# Altium schematic sheet 59. CURRENT MONITORS -INA231.SchDoc: CURRENT MONITORS - INA231
size 513 x 386 mm; Project: PROC154E2(001)_SK_AM69; Issue: 1.0; RevCode: E3; Page Create Date: March  8, 1995; Variant Name: Core Design; Schematic Page Number: 59; Page Number: 59; Page Size: C; Comment: MISTRAL_TITLEBLK_CSIZE_1; Page Count: 62; Schematic Page Count: 62; Name: PROC154E2 001 SK AM69; DsnPath: C:\Users\danie\Downloads\sprr466c\PROC154E3_RP\PROC154E3_SCH.DSN; SchematicName: SCHEMATIC1; PageName: 59. CURRENT MONITORS -INA231; PageSize: C; TopSchematic: True
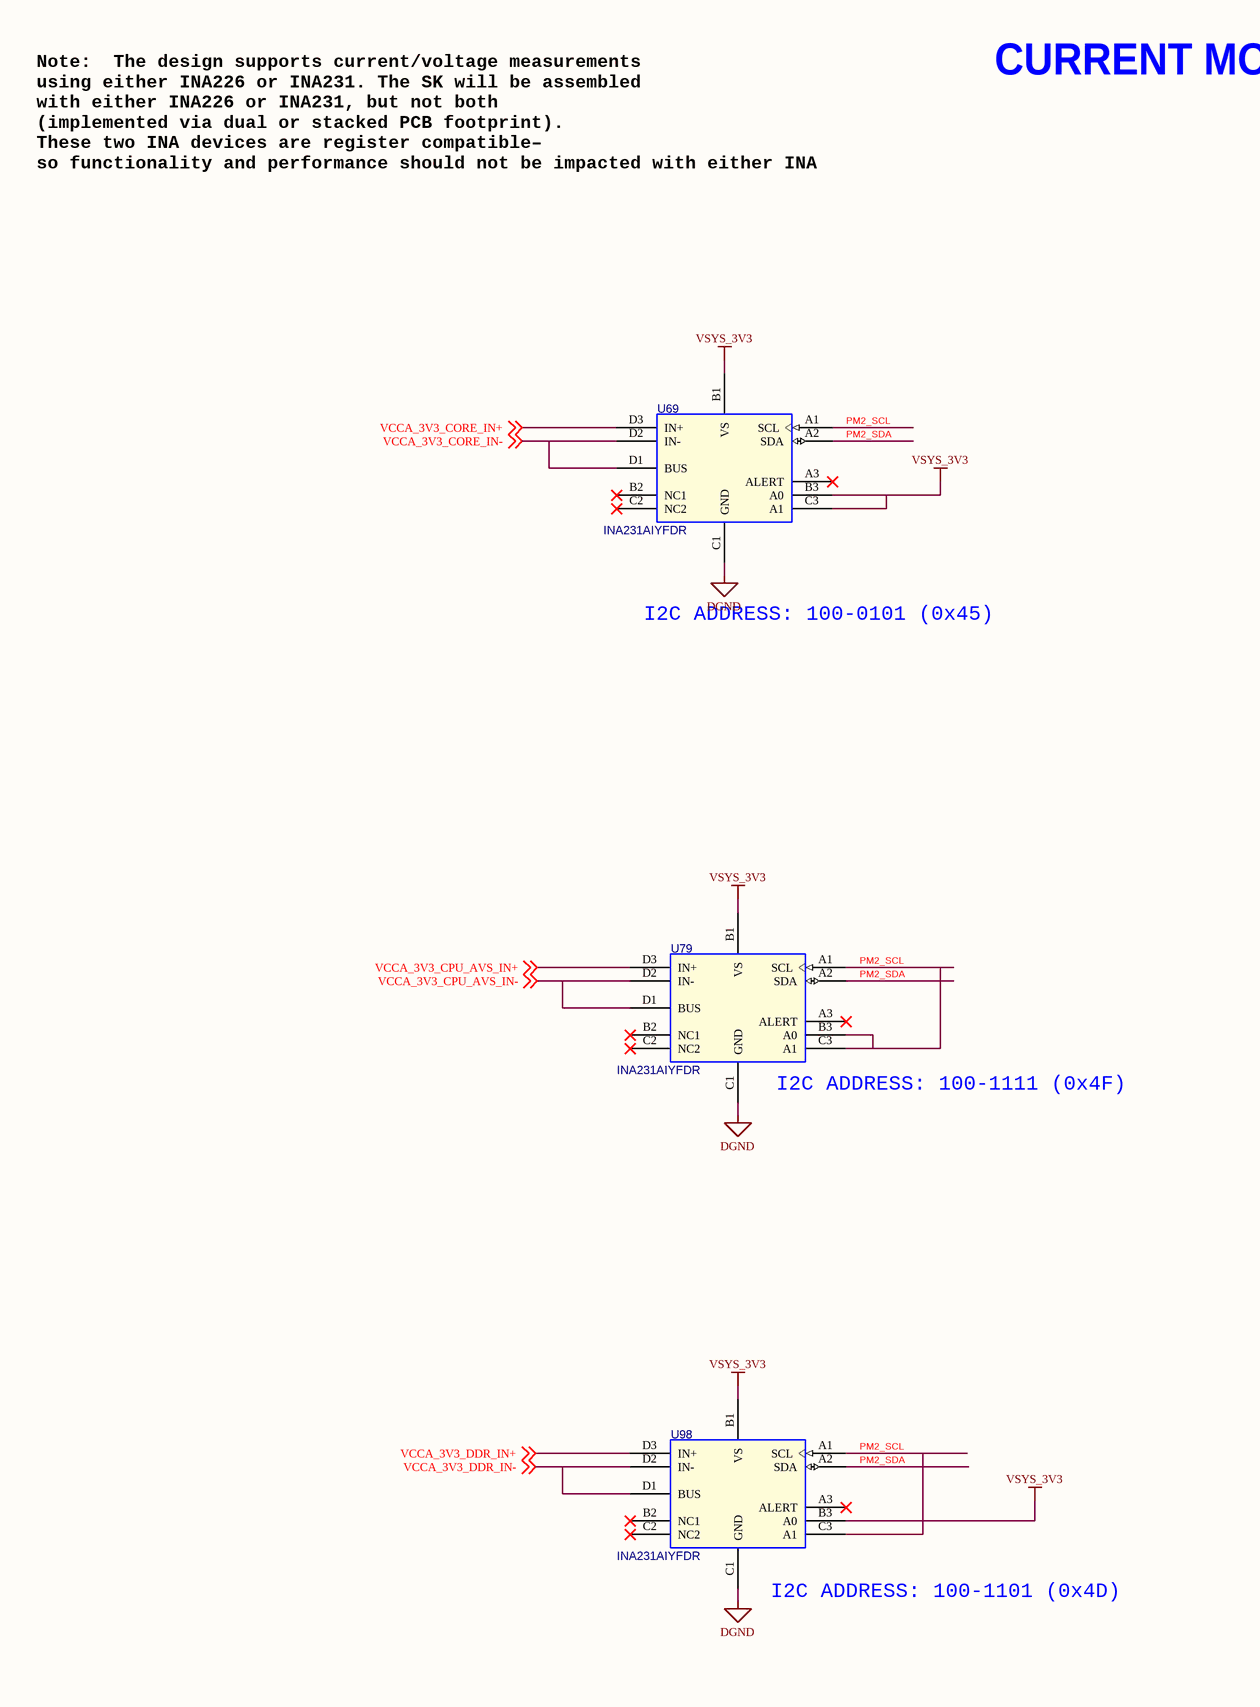
[diagram p0: 59. CURRENT MONITORS -INA231.SchDoc, left]
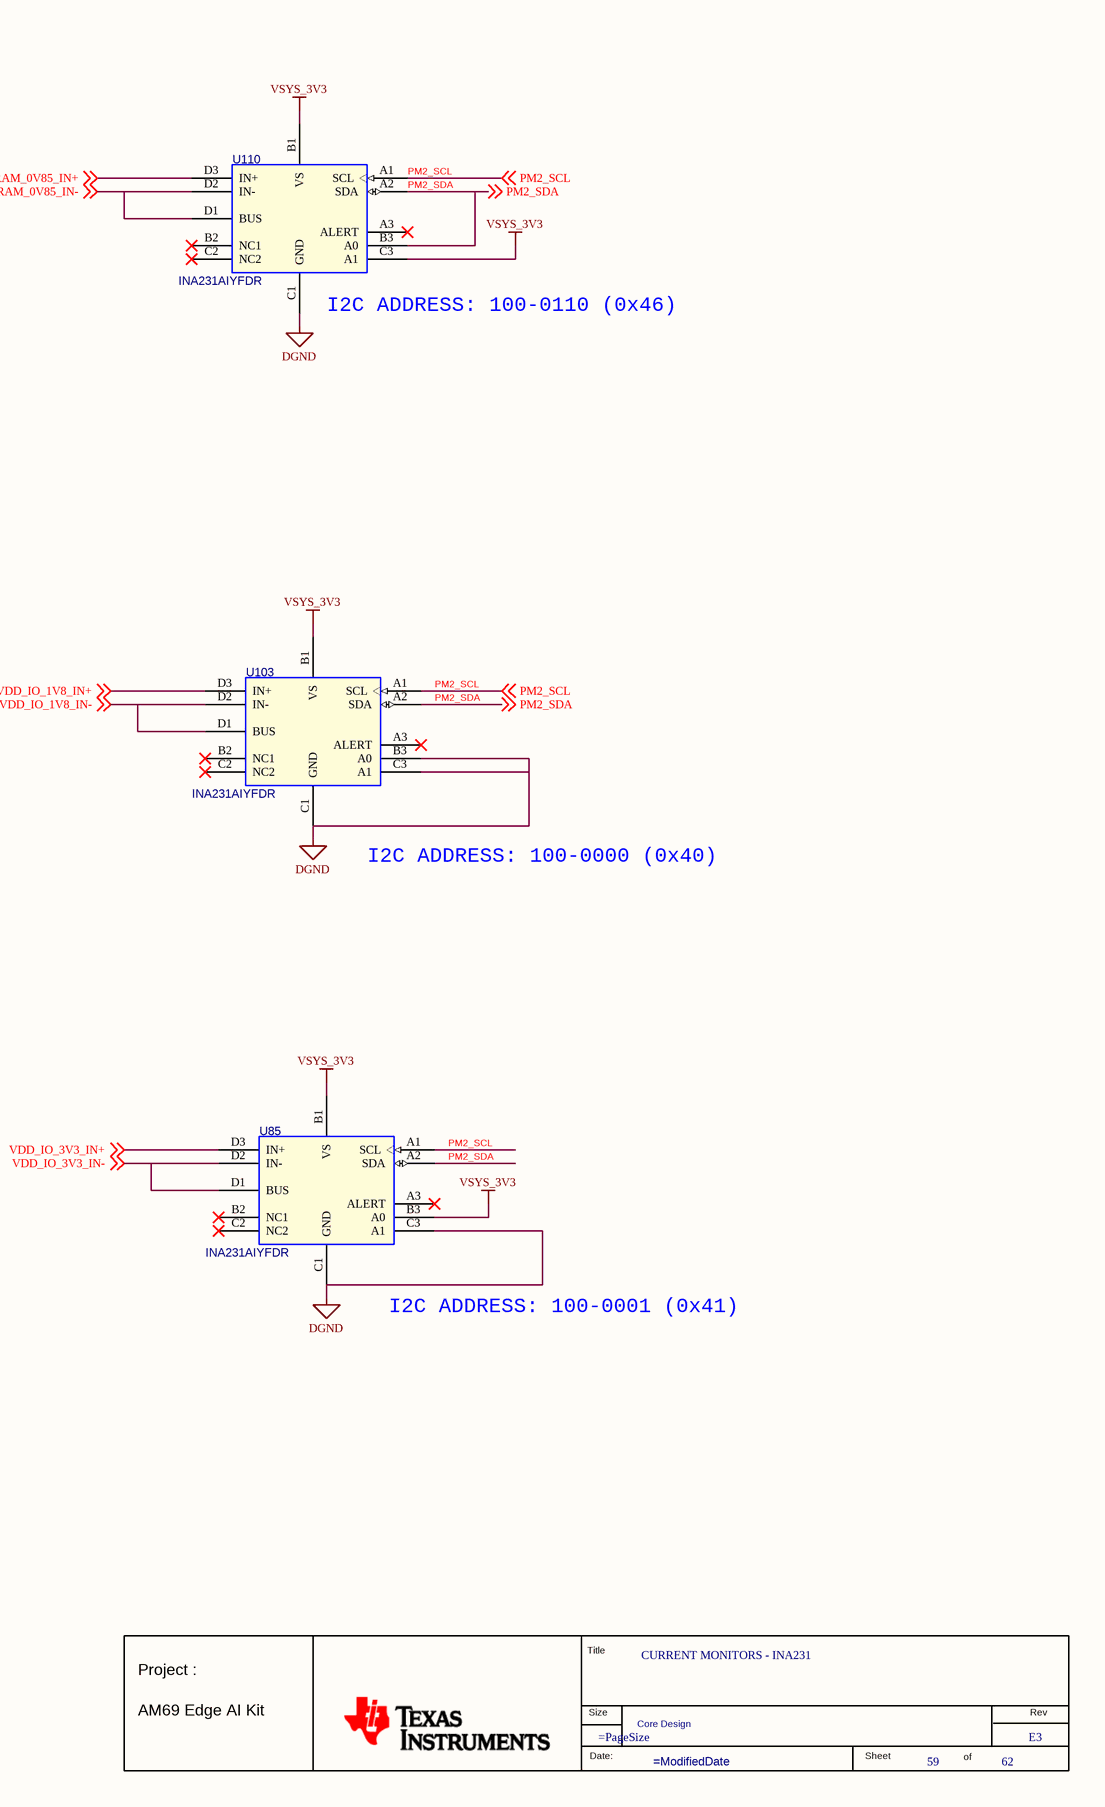
[diagram p1: 59. CURRENT MONITORS -INA231.SchDoc, right]

## Parts
*  RevCode: E3  Title: CURRENT MONITORS - INA231  Page Number: 59  Page Count: 62  Variant Name: Core Design  (hidden comment: MISTRAL_TITLEBLK_CSIZE_1)  (graphical)
U69  INA231AIYFDR  [DSBGA12_15-74_60X70_0-4]
U79  INA231AIYFDR  [DSBGA12_15-74_60X70_0-4]
U85  INA231AIYFDR  [DSBGA12_15-74_60X70_0-4]
U98  INA231AIYFDR  [DSBGA12_15-74_60X70_0-4]
U103  INA231AIYFDR  [DSBGA12_15-74_60X70_0-4]
U110  INA231AIYFDR  [DSBGA12_15-74_60X70_0-4]

## Nets
DGND: U69.C1(GND) U79.C1(GND) U85.C1(GND) U85.C3(A1) U98.C1(GND) U103.B3(A0) U103.C1(GND) U103.C3(A1) U110.C1(GND)
VSYS_3V3: U69.B1(VS) U69.B3(A0) U69.C3(A1) U79.B1(VS) U85.B1(VS) U85.B3(A0) U98.B1(VS) U98.B3(A0) U103.B1(VS) U110.B1(VS) U110.C3(A1)
CORE_RAM_0V85_IN+: U110.D3(IN+) ; off-sheet CORE_RAM_0V85_IN+
CORE_RAM_0V85_IN-: U110.D1(BUS) U110.D2(IN-) ; off-sheet CORE_RAM_0V85_IN-
PM2_SCL: U69.A1(SCL) U79.A1(SCL) U79.B3(A0) U79.C3(A1) U85.A1(SCL) U98.A1(SCL) U98.C3(A1) U103.A1(SCL) U110.A1(SCL) ; off-sheet PM2_SCL
PM2_SDA: U69.A2(SDA) U79.A2(SDA) U85.A2(SDA) U98.A2(SDA) U103.A2(SDA) U110.A2(SDA) U110.B3(A0) ; off-sheet PM2_SDA
VCCA_3V3_CORE_IN+: U69.D3(IN+) ; off-sheet VCCA_3V3_CORE_IN+
VCCA_3V3_CORE_IN-: U69.D1(BUS) U69.D2(IN-) ; off-sheet VCCA_3V3_CORE_IN-
VCCA_3V3_CPU_AVS_IN+: U79.D3(IN+) ; off-sheet VCCA_3V3_CPU_AVS_IN+
VCCA_3V3_CPU_AVS_IN-: U79.D1(BUS) U79.D2(IN-) ; off-sheet VCCA_3V3_CPU_AVS_IN-
VCCA_3V3_DDR_IN+: U98.D3(IN+) ; off-sheet VCCA_3V3_DDR_IN+
VCCA_3V3_DDR_IN-: U98.D1(BUS) U98.D2(IN-) ; off-sheet VCCA_3V3_DDR_IN-
VDD_IO_1V8_IN+: U103.D3(IN+) ; off-sheet VDD_IO_1V8_IN+
VDD_IO_1V8_IN-: U103.D1(BUS) U103.D2(IN-) ; off-sheet VDD_IO_1V8_IN-
VDD_IO_3V3_IN+: U85.D3(IN+) ; off-sheet VDD_IO_3V3_IN+
VDD_IO_3V3_IN-: U85.D1(BUS) U85.D2(IN-) ; off-sheet VDD_IO_3V3_IN-

Not connected (* = marked no-connect by the designer): U69 A3(ALERT)* B2(NC1)* C2(NC2)*; U79 A3(ALERT)* B2(NC1)* C2(NC2)*; U85 A3(ALERT)* B2(NC1)* C2(NC2)*; U98 A3(ALERT)* B2(NC1)* C2(NC2)*; U103 A3(ALERT)* B2(NC1)* C2(NC2)*; U110 A3(ALERT)* B2(NC1)* C2(NC2)*

## Notes on the sheet
- Note:  The design supports current/voltage measurements
  using either INA226 or INA231. The SK will be assembled
  with either INA226 or INA231, but not both
  (implemented via dual or stacked PCB footprint).
  These two INA devices are register compatible–
  so functionality and performance should not be impacted with either INA
- CURRENT MONITORS - INA231
- (near U110) I2C ADDRESS: 100-0110 (0x46)
- I2C ADDRESS: 100-0101 (0x45)
- (near U79) I2C ADDRESS: 100-1111 (0x4F)
- I2C ADDRESS: 100-0000 (0x40)
- (near U98) I2C ADDRESS: 100-1101 (0x4D)
- (near U85) I2C ADDRESS: 100-0001 (0x41)
- (in symbol MISTRAL_TITLEBLK_CSIZE_1) Title; Project :; Size; Rev; AM69 Edge AI Kit; Date:; Sheet; of

## Library data of the parts
* = MISTRAL_TITLEBLK_CSIZE_1: Issue: 1.0; Project: PROC154E2(001)_SK_AM69; Name: PROC154E2 001 SK AM69; Page Create Date: March  8, 1995; Page Size: =PageSize; Page Modify Date: =ModifiedDate; Schematic Page Count: 62; Schematic Page Number: 59
U69 = INA231_DSBGA12: IC HIGH OR LOW SIDE MEASUREMENT BI-DIR CURRENT AND POWER MONITOR WITH 1.8V I2C INTERFACE DSBGA12; Part Reference: U69; Mistral Part No: 142021080022-R; Mfr_name: TEXAS INSTRUMENTS; Part_type: ICS\POWER\MANAGEMENT; Project: TI_AM62x SVB_BRD; Tolerance: NA; Customs_HS_Code: 85423100; Custom_Duty: 15%; Value: INA231AIYFDR; PCB Footprint: DSBGA12_15-74_60X70_0-4; Footprint Ref: DSBGA12_15-74_60X70_0-4; Mfr_part_number: INA231AIYFDR; Voltage: NA; Wattage: NA; Package: DSBGA12; Distributor_name: DIGIKEY; Distributor_part_number: 296-49645-1-ND; Library Ref: INA231_DSBGA12; Height: 0.40MM; Weight: 200mg; Temperature: -40°C+125°C; Datasheet: Y:\MIS_DATABASE\DATASHEETS\ICS\POWER\INA231XXX.PDF; Crtd /date: ALVY/250821; Chkd/date: MANIRAJA/250821; MECHANICAL 3D STEP FILE: DSBGA12_15-74_60X70_0-4; Library Path: Y:\MIS_DATABASE\Library\ALTIUM_TOOL\SCHEMATICS_PARTS\MS_MISCPOWER_Library.schlib; Footprint Path: Y:\MIS_DATABASE\Library\ALTIUM_TOOL\PCB_FOOTPRINTS\Altium_Footprint_Lib.PcbLib; Manufacturer: TEXAS INSTRUMENTS
U79 = INA231_DSBGA12: IC HIGH OR LOW SIDE MEASUREMENT BI-DIR CURRENT AND POWER MONITOR WITH 1.8V I2C INTERFACE DSBGA12; Part Reference: U79; Mistral Part No: 142021080022-R; Mfr_name: TEXAS INSTRUMENTS; Part_type: ICS\POWER\MANAGEMENT; Project: TI_AM62x SVB_BRD; Tolerance: NA; Customs_HS_Code: 85423100; Custom_Duty: 15%; Value: INA231AIYFDR; PCB Footprint: DSBGA12_15-74_60X70_0-4; Footprint Ref: DSBGA12_15-74_60X70_0-4; Mfr_part_number: INA231AIYFDR; Voltage: NA; Wattage: NA; Package: DSBGA12; Distributor_name: DIGIKEY; Distributor_part_number: 296-49645-1-ND; Library Ref: INA231_DSBGA12; Height: 0.40MM; Weight: 200mg; Temperature: -40°C+125°C; Datasheet: Y:\MIS_DATABASE\DATASHEETS\ICS\POWER\INA231XXX.PDF; Crtd /date: ALVY/250821; Chkd/date: MANIRAJA/250821; MECHANICAL 3D STEP FILE: DSBGA12_15-74_60X70_0-4; Library Path: Y:\MIS_DATABASE\Library\ALTIUM_TOOL\SCHEMATICS_PARTS\MS_MISCPOWER_Library.schlib; Footprint Path: Y:\MIS_DATABASE\Library\ALTIUM_TOOL\PCB_FOOTPRINTS\Altium_Footprint_Lib.PcbLib; Manufacturer: TEXAS INSTRUMENTS
U85 = INA231_DSBGA12: IC HIGH OR LOW SIDE MEASUREMENT BI-DIR CURRENT AND POWER MONITOR WITH 1.8V I2C INTERFACE DSBGA12; Part Reference: U85; Manufacturer: TEXAS INSTRUMENTS; Part_type: ICS\POWER\MANAGEMENT; Mistral Part No: 142021080022-R; Custom_Duty: 15%; Customs_HS_Code: 85423100; Wattage: NA; Project: TI_AM62x SVB_BRD; Value: INA231AIYFDR; PCB Footprint: DSBGA12_15-74_60X70_0-4; Footprint Path: Y:\MIS_DATABASE\Library\ALTIUM_TOOL\PCB_FOOTPRINTS\Altium_Footprint_Lib.PcbLib; Library Path: Y:\MIS_DATABASE\Library\ALTIUM_TOOL\SCHEMATICS_PARTS\MS_MISCPOWER_Library.schlib; MECHANICAL 3D STEP FILE: DSBGA12_15-74_60X70_0-4; Chkd/date: MANIRAJA/250821; Crtd /date: ALVY/250821; Datasheet: Y:\MIS_DATABASE\DATASHEETS\ICS\POWER\INA231XXX.PDF; Temperature: -40°C+125°C; Weight: 200mg; Height: 0.40MM; Library Ref: INA231_DSBGA12; Distributor_part_number: 296-49645-1-ND; Distributor_name: DIGIKEY; Package: DSBGA12; Voltage: NA; Tolerance: NA; Mfr_part_number: INA231AIYFDR; Mfr_name: TEXAS INSTRUMENTS; Footprint Ref: DSBGA12_15-74_60X70_0-4
U98 = INA231_DSBGA12: IC HIGH OR LOW SIDE MEASUREMENT BI-DIR CURRENT AND POWER MONITOR WITH 1.8V I2C INTERFACE DSBGA12; Part Reference: U98; Manufacturer: TEXAS INSTRUMENTS; Part_type: ICS\POWER\MANAGEMENT; Mistral Part No: 142021080022-R; Custom_Duty: 15%; Customs_HS_Code: 85423100; Wattage: NA; Project: TI_AM62x SVB_BRD; Value: INA231AIYFDR; PCB Footprint: DSBGA12_15-74_60X70_0-4; Footprint Path: Y:\MIS_DATABASE\Library\ALTIUM_TOOL\PCB_FOOTPRINTS\Altium_Footprint_Lib.PcbLib; Library Path: Y:\MIS_DATABASE\Library\ALTIUM_TOOL\SCHEMATICS_PARTS\MS_MISCPOWER_Library.schlib; MECHANICAL 3D STEP FILE: DSBGA12_15-74_60X70_0-4; Chkd/date: MANIRAJA/250821; Crtd /date: ALVY/250821; Datasheet: Y:\MIS_DATABASE\DATASHEETS\ICS\POWER\INA231XXX.PDF; Temperature: -40°C+125°C; Weight: 200mg; Height: 0.40MM; Library Ref: INA231_DSBGA12; Distributor_part_number: 296-49645-1-ND; Distributor_name: DIGIKEY; Package: DSBGA12; Voltage: NA; Tolerance: NA; Mfr_part_number: INA231AIYFDR; Mfr_name: TEXAS INSTRUMENTS; Footprint Ref: DSBGA12_15-74_60X70_0-4
U103 = INA231_DSBGA12: IC HIGH OR LOW SIDE MEASUREMENT BI-DIR CURRENT AND POWER MONITOR WITH 1.8V I2C INTERFACE DSBGA12; Part Reference: U103; Part_type: ICS\POWER\MANAGEMENT; Mfr_name: TEXAS INSTRUMENTS; Mistral Part No: 142021080022-R; Custom_Duty: 15%; Customs_HS_Code: 85423100; Wattage: NA; Project: TI_AM62x SVB_BRD; Value: INA231AIYFDR; PCB Footprint: DSBGA12_15-74_60X70_0-4; Footprint Path: Y:\MIS_DATABASE\Library\ALTIUM_TOOL\PCB_FOOTPRINTS\Altium_Footprint_Lib.PcbLib; Library Path: Y:\MIS_DATABASE\Library\ALTIUM_TOOL\SCHEMATICS_PARTS\MS_MISCPOWER_Library.schlib; MECHANICAL 3D STEP FILE: DSBGA12_15-74_60X70_0-4; Chkd/date: MANIRAJA/250821; Crtd /date: ALVY/250821; Datasheet: Y:\MIS_DATABASE\DATASHEETS\ICS\POWER\INA231XXX.PDF; Temperature: -40°C+125°C; Weight: 200mg; Height: 0.40MM; Library Ref: INA231_DSBGA12; Distributor_part_number: 296-49645-1-ND; Distributor_name: DIGIKEY; Package: DSBGA12; Voltage: NA; Tolerance: NA; Mfr_part_number: INA231AIYFDR; Footprint Ref: DSBGA12_15-74_60X70_0-4; Manufacturer: TEXAS INSTRUMENTS
U110 = INA231_DSBGA12: IC HIGH OR LOW SIDE MEASUREMENT BI-DIR CURRENT AND POWER MONITOR WITH 1.8V I2C INTERFACE DSBGA12; Part Reference: U110; Mistral Part No: 142021080022-R; Mfr_name: TEXAS INSTRUMENTS; Part_type: ICS\POWER\MANAGEMENT; Project: TI_AM62x SVB_BRD; Tolerance: NA; Customs_HS_Code: 85423100; Custom_Duty: 15%; Value: INA231AIYFDR; PCB Footprint: DSBGA12_15-74_60X70_0-4; Footprint Ref: DSBGA12_15-74_60X70_0-4; Mfr_part_number: INA231AIYFDR; Voltage: NA; Wattage: NA; Package: DSBGA12; Distributor_name: DIGIKEY; Distributor_part_number: 296-49645-1-ND; Library Ref: INA231_DSBGA12; Height: 0.40MM; Weight: 200mg; Temperature: -40°C+125°C; Datasheet: Y:\MIS_DATABASE\DATASHEETS\ICS\POWER\INA231XXX.PDF; Crtd /date: ALVY/250821; Chkd/date: MANIRAJA/250821; MECHANICAL 3D STEP FILE: DSBGA12_15-74_60X70_0-4; Library Path: Y:\MIS_DATABASE\Library\ALTIUM_TOOL\SCHEMATICS_PARTS\MS_MISCPOWER_Library.schlib; Footprint Path: Y:\MIS_DATABASE\Library\ALTIUM_TOOL\PCB_FOOTPRINTS\Altium_Footprint_Lib.PcbLib; Manufacturer: TEXAS INSTRUMENTS